# Altium schematic sheet Sch1_TP2_EJ3.SchDoc
size A
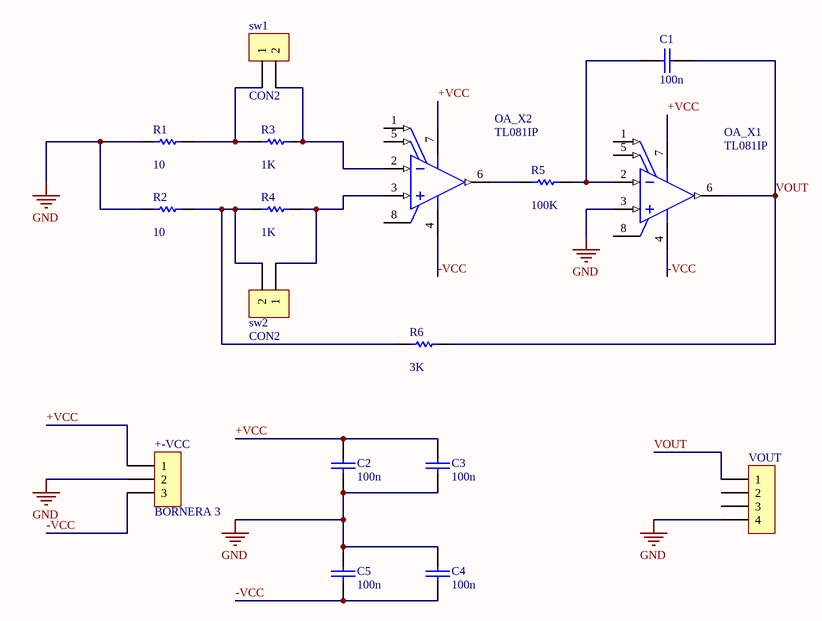
[diagram p0: Sch1_TP2_EJ3.SchDoc]

## Parts
+-VCC  BORNERA 3  [BORNERA3]
C1  100n  [CAP100]
C2  100n  [CAP100]
C3  100n  [CAP100]
C4  100n  [CAP100]
C5  100n  [CAP100]
OA_X1  TL081IP  [TI-P8]
OA_X2  TL081IP  [TI-P8]
R1  value 10  [AXIAL-0.3]
R2  value 10  [AXIAL-0.3]
R3  value 1K  [AXIAL-0.3]
R4  value 1K  [AXIAL-0.3]
R5  value 100K  [AXIAL-0.3]
R6  value 3K  [AXIAL-0.3]
sw1  CON2  [SIP2]
sw2  CON2  [SIP2]
VOUT  (no value)  [SIP4]

## Nets
GND: +-VCC.2 C2.2 C3.2 C4.1 C5.1 OA_X1.3(IN+) R1.1 R2.1 VOUT.4
+VCC: +-VCC.1 C2.1 C3.1 OA_X1.7(VCC+) OA_X2.7(VCC+)
-VCC: +-VCC.3 C4.2 C5.2 OA_X1.4(VCC-) OA_X2.4(VCC-)
VOUT: C1.2 OA_X1.6(OUT) R6.2 VOUT.1
NetC1_1: C1.1 OA_X1.2(IN-) R5.2
NetOA_X2_2: OA_X2.2(IN-) R3.2 sw1.2
NetOA_X2_3: OA_X2.3(IN+) R4.2 sw2.1
NetOA_X2_6: OA_X2.6(OUT) R5.1
NetR1_2: R1.2 R3.1 sw1.1
NetR2_2: R2.2 R4.1 R6.1 sw2.2

Not connected (* = marked no-connect by the designer): OA_X1 1(OFFSET_N1) 5(OFFSET_N2) 8(NC); OA_X2 1(OFFSET_N1) 5(OFFSET_N2) 8(NC); VOUT 2 3

## Library data of the parts
C1-C5 = CAP
OA_X1 OA_X2 = TL081IP: JFET-Input Operational Amplifier, 7 to 36 V, -40 to 85 degC, 8-pin DIP (P8), Pb-Free (RoHS); Manufacturer: Texas Instruments; CMRR(Min)(dB): 75; Eco-Plan: Green (RoHS & no Sb/Br); GBW(Typ)(MHz): 3; IIB(Max)(pA): 400; Iq per channel(Max)(mA): 2.8; Number of Channels: 1; Offset Drift(Typ)(uV/C): 18; Rating: Military; Slew Rate(Typ)(V/us): 13; Sub Family: General Purpose Amplifier, High Supply Voltage Amplifier (>=30V); Total Supply Voltage(Max)(+5V is 5, +/-5V is 10): 36; Total Supply Voltage(Min)(+5V is 5, +/-5V is 10): 7; Vio (25C)(Max)(mV): 15; DatasheetVersion: SLOS081G; PackageVersion: 4040082/E, 04/2010; PackageReference: P8; PackageDescription: 8-Pin Plastic In-Line, Body 9.59 x 6.35 mm, Pitch 2.54 mm; Supplier 1: Digi-Key; Supplier Part Number 1: TL081IP-ND; Supplier 2: Newark; Supplier Part Number 2: 31C2501; Supplier 3: Mouser; Supplier Part Number 3: 595-TL081IP; Vn at 1kHz(Typ)(nV/rtHz): 18; Mounting Technology: Through Hole; Code_JEDEC: MS-001; PartNumber: TL081IP; ComponentLink1Description: Manufacturer URL; ComponentLink1URL: http://www.ti.com/; ComponentLink2Description: Datasheet; ComponentLink2URL: http://www.ti.com/lit/ds/symlink/tl081.pdf; ComponentLink3Description: Package Specification; ComponentLink3URL: http://www.ti.com/litv/pdf/mpdi001b
R1-R6 = Res1: Resistor; Published: 8-Jun-2000; LatestRevisionDate: 17-Jul-2002; LatestRevisionNote: Re-released for DXP Platform.; PackageReference: AXIAL-0.3; Publisher: Altium Limited; PackageDescription: Axial Device, Thru-Hole; 2 Leads; 0.3 in Pin Spacing
VOUT = CON4